# Altium project Motor Driver.PrjPcb
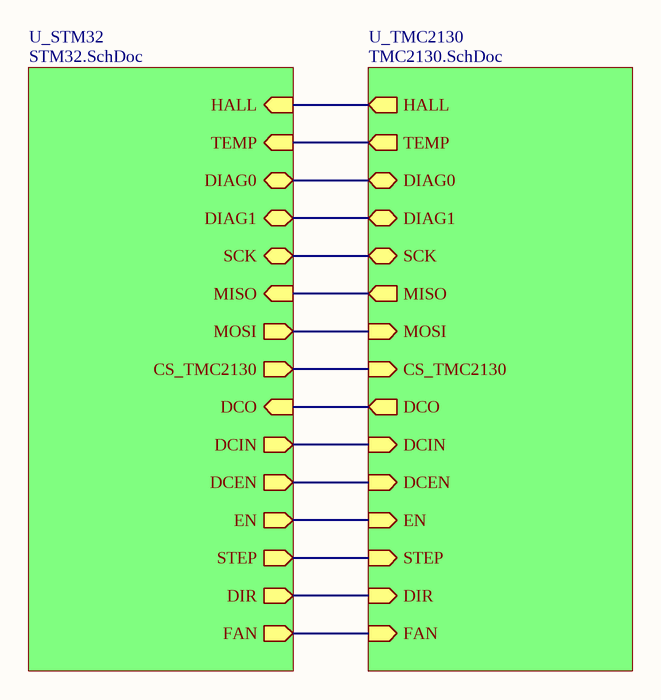
[diagram p0: Top.SchDoc]
3 sheets, 58 parts. Net scope: hierarchical (ports join the sheet entries above them; power ports are global).
Board file: PCB1.PcbDoc
Sheets:
  Top.SchDoc
    U_STM32 = STM32.SchDoc
    U_TMC2130 = TMC2130.SchDoc

## Sheet Top.SchDoc
size A

### Sub-sheets
U_STM32 = STM32.SchDoc: CS_TMC2130 (out), DIR (out), MISO (in), MOSI (out), SCK (bidir), EN (out), DIAG0 (bidir), HALL (in), DCO (in), DCEN (out), TEMP (in), DIAG1 (bidir), DCIN (out), STEP (out), FAN (out)
U_TMC2130 = TMC2130.SchDoc: DIAG1 (bidir), DIAG0 (bidir), DCO (out), DCIN (in), TEMP (out), HALL (out), DCEN (in), MOSI (in), SCK (bidir), MISO (out), STEP (in), DIR (in), EN (in), CS_TMC2130 (in), FAN (in)

### Nets
NetQ1_1: sheet U_STM32/FAN, sheet U_TMC2130/FAN
NetR2_2: sheet U_STM32/TEMP, sheet U_TMC2130/TEMP
NetU1_10: sheet U_STM32/CS_TMC2130, sheet U_TMC2130/CS_TMC2130
NetU1_11: sheet U_STM32/HALL, sheet U_TMC2130/HALL
NetU1_12: sheet U_STM32/EN, sheet U_TMC2130/EN
NetU1_13: sheet U_STM32/STEP, sheet U_TMC2130/STEP
NetU1_14: sheet U_STM32/DIR, sheet U_TMC2130/DIR
NetU1_15: sheet U_STM32/SCK, sheet U_TMC2130/SCK
NetU1_16: sheet U_STM32/MISO, sheet U_TMC2130/MISO
NetU1_17: sheet U_STM32/MOSI, sheet U_TMC2130/MOSI
NetU1_26: sheet U_STM32/DCO, sheet U_TMC2130/DCO
NetU1_27: sheet U_STM32/DCEN, sheet U_TMC2130/DCEN
NetU1_28: sheet U_STM32/DCIN, sheet U_TMC2130/DCIN
NetU1_45: sheet U_STM32/DIAG0, sheet U_TMC2130/DIAG0
NetU1_46: sheet U_STM32/DIAG1, sheet U_TMC2130/DIAG1

## Sheet STM32.SchDoc: Microcontroller & Communication
size A; Author: Luka & Emile; DrawnBy: Luka & Emile; Revision: 0.1; SheetNumber: 1; SheetTotal: 2
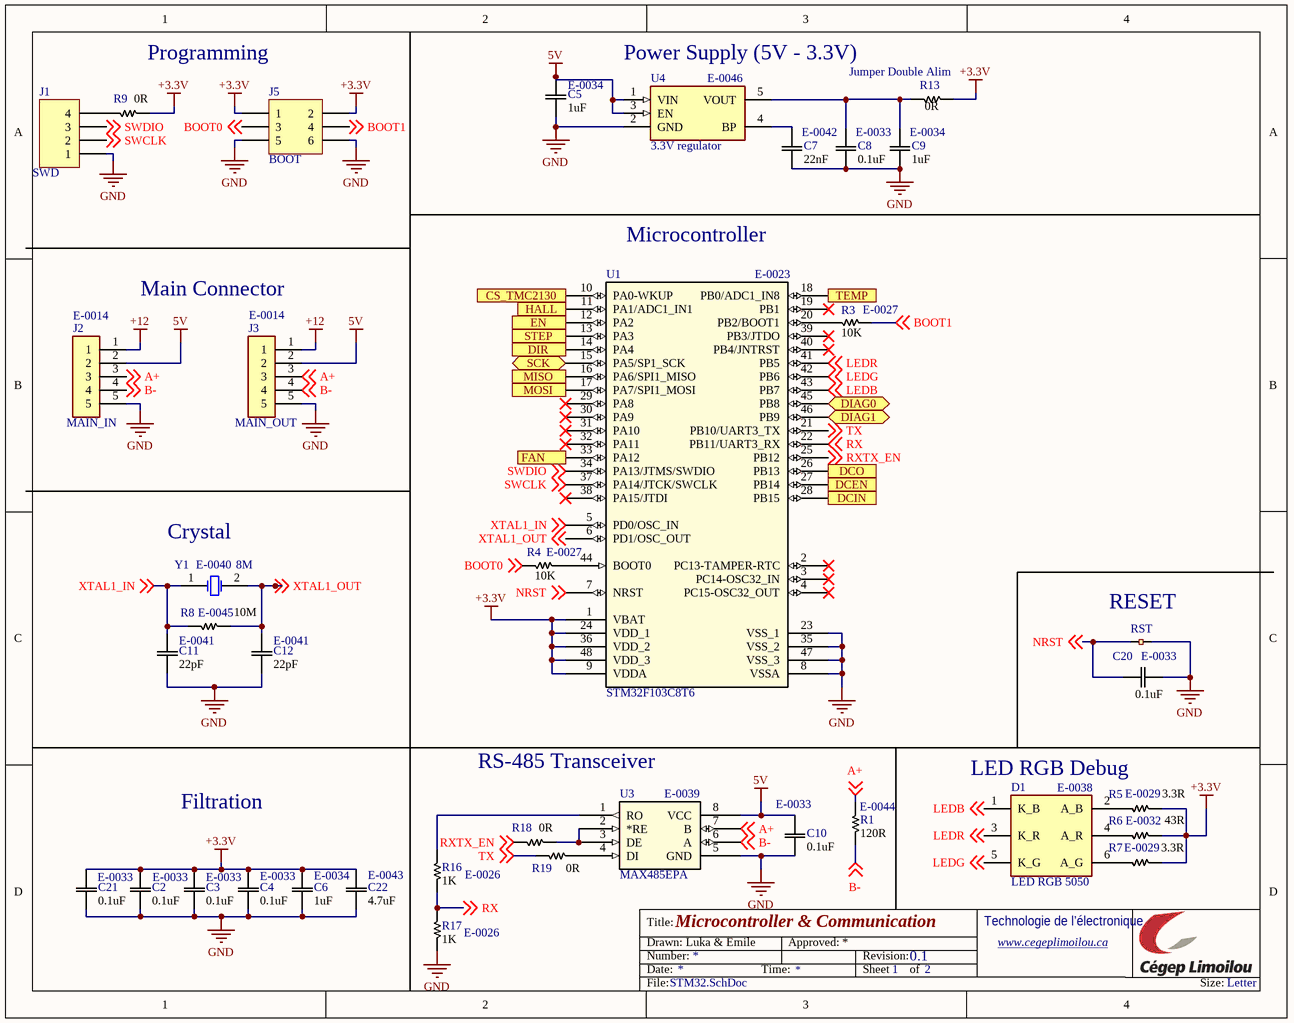
[diagram p1: STM32.SchDoc]

### Parts
C2  value 0.1uF  [0603]  (hidden comment: E-0033)
C3  value 0.1uF  [0603]  (hidden comment: E-0033)
C4  value 0.1uF  [0603]  (hidden comment: E-0033)
C5  value 1uF  [0603]  (hidden comment: E-0034)
C6  value 1uF  [0603]  (hidden comment: E-0034)
C7  value 22nF  [0603]  (hidden comment: E-0042)
C8  value 0.1uF  [0603]  (hidden comment: E-0033)
C9  value 1uF  [0603]  (hidden comment: E-0034)
C10  value 0.1uF  [0603]  (hidden comment: E-0033)
C11  value 22pF  [0603]  (hidden comment: E-0041)
C12  value 22pF  [0603]  (hidden comment: E-0041)
C20  value 0.1uF  [0603]  (hidden comment: E-0033)
C21  value 0.1uF  [0603]  (hidden comment: E-0033)
C22  value 4.7uF  [0603]  (hidden comment: E-0043)
D1  LED RGB 5050  [LED 5050]
J1  SWD  [HDR1X4]
J2  MAIN_IN  [JST 5POS 2.5mm 90°]
J3  MAIN_OUT  [JST 5POS 2.5mm 90°]
J5  BOOT  [Header 3x2 1.27mm SMD]
R1  value 120R  [0603]  (hidden comment: E-0044)
R3  value 10K  [0603]  (hidden comment: E-0027)
R4  value 10K  [0603]  (hidden comment: Resistor 0603)
R5  value 3.3R  [0603]  (hidden comment: E-0029)
R6  value 43R  [0603]  (hidden comment: E-0032)
R7  value 3.3R  [0603]  (hidden comment: E-0029)
R8  value 10M  [0603]  (hidden comment: E-0045)
R9  value 0R  [0603]  (hidden comment: Jumper)
R13  value 0R  [0603]  (hidden comment: Jumper)
R16  value 1K  [0603]  (hidden comment: E-0026)
R17  value 1K  [0603]  (hidden comment: E-0026)
R18  value 0R  [0603]  (hidden comment: Jumper)
R19  value 0R  [0603]  (hidden comment: Jumper)
RST  (no value)  [PAD]
U1  STM32F103C8T6  [LQFP-48]
U3  MAX485EPA  [DIP 8 - 3D]
U4  3.3V regulator  [SOT94P279X130-5N]
Y1  8M  [ATS080B-E]

### Ports
CS_TMC2130 (out), DCEN (out), DCIN (out), DCO (in), DIAG0 (bidir), DIAG1 (bidir), DIR (out), EN (out), FAN (out), HALL (in), MISO (in), MOSI (out), SCK (bidir), STEP (out), TEMP (in)

### Nets
5V: C5.2 C10.2 J2.2 J3.2 U3.8(VCC) U4.1(VIN) U4.3(EN)
+3.3V: C2.2 C3.2 C4.2 C6.2 C21.2 C22.2 J5.1 J5.2 R5.2 R6.2 R7.2 R9.2 R13.2 U1.1(VBAT) U1.9(VDDA) U1.24(VDD_1) U1.36(VDD_2) U1.48(VDD_3)
+12: J2.1 J3.1
GND: C2.1 C3.1 C4.1 C5.1 C6.1 C7.1 C8.1 C9.1 C10.1 C11.1 C12.1 C20.1 C21.1 C22.1 J1.1 J2.5 J3.5 J5.5 J5.6 R17.2 RST.1 U1.8(VSSA) U1.23(VSS_1) U1.35(VSS_2) U1.47(VSS_3) U3.5(GND) U4.2(GND)
A+: J2.3 J3.3 R1.2 U3.7(B) ; off-sheet A+
B-: J2.4 J3.4 R1.1 U3.6(A) ; off-sheet B-
BOOT0: J5.3 R4.1 ; off-sheet BOOT0
BOOT1: J5.4 R3.2 ; off-sheet BOOT1
LEDB: D1.1(K_B) U1.43(PB7) ; off-sheet LEDB
LEDG: D1.5(K_G) U1.42(PB6) ; off-sheet LEDG
LEDR: D1.3(K_R) U1.41(PB5) ; off-sheet LEDR
NRST: C20.2 RST.2 U1.7(NRST) ; off-sheet NRST
RX: R16.2 R17.1 U1.22(PB11/UART3_RX) ; off-sheet RX
RXTX_EN: R18.1 U1.25(PB12) ; off-sheet RXTX_EN
SWCLK: J1.2 U1.37(PA14/JTCK/SWCLK) ; off-sheet SWCLK
SWDIO: J1.3 U1.34(PA13/JTMS/SWDIO) ; off-sheet SWDIO
TX: R19.1 U1.21(PB10/UART3_TX) ; off-sheet TX
XTAL1_IN: C11.2 R8.1 U1.5(PD0/OSC_IN) Y1.1(OSC1) ; off-sheet XTAL1_IN
XTAL1_OUT: C12.2 R8.2 U1.6(PD1/OSC_OUT) Y1.2(OSC2) ; off-sheet XTAL1_OUT
NetC7_2: C7.2 U4.4(BP)
NetC8_2: C8.2 C9.2 R13.1 U4.5(VOUT)
NetD1_2: D1.2(A_B) R5.1
NetD1_4: D1.4(A_R) R6.1
NetD1_6: D1.6(A_G) R7.1
NetJ1_4: J1.4 R9.1
NetQ1_1: U1.33(PA12) ; port FAN
NetR2_2: U1.18(PB0/ADC1_IN8) ; port TEMP
NetR3_1: R3.1 U1.20(PB2/BOOT1)
NetR4_2: R4.2 U1.44(BOOT0)
NetR16_1: R16.1 U3.1(RO)
NetR18_2: R18.2 U3.2(*RE) U3.3(DE)
NetR19_2: R19.2 U3.4(DI)
NetU1_10: U1.10(PA0-WKUP) ; port CS_TMC2130
NetU1_11: U1.11(PA1/ADC1_IN1) ; port HALL
NetU1_12: U1.12(PA2) ; port EN
NetU1_13: U1.13(PA3) ; port STEP
NetU1_14: U1.14(PA4) ; port DIR
NetU1_15: U1.15(PA5/SP1_SCK) ; port SCK
NetU1_16: U1.16(PA6/SPI1_MISO) ; port MISO
NetU1_17: U1.17(PA7/SPI1_MOSI) ; port MOSI
NetU1_26: U1.26(PB13) ; port DCO
NetU1_27: U1.27(PB14) ; port DCEN
NetU1_28: U1.28(PB15) ; port DCIN
NetU1_45: U1.45(PB8) ; port DIAG0
NetU1_46: U1.46(PB9) ; port DIAG1

Not connected (* = marked no-connect by the designer): U1 2(PC13-TAMPER-RTC)* 3(PC14-OSC32_IN)* 4(PC15-OSC32_OUT)* 19(PB1)* 29(PA8)* 30(PA9)* 31(PA10)* 32(PA11)* 38(PA15/JTDI)* 39(PB3/JTDO)* 40(PB4/JNTRST)*

### Notes on the sheet
- Programming
- Power Supply (5V - 3.3V)
- (near R13) Jumper Double Alim
- Main Connector
- Microcontroller
- (near Y1) Crystal
- (near RST) RESET
- (near U3) RS-485 Transceiver
- LED RGB Debug
- Filtration
- Title:
- Number:
- Date:
- Drawn:
- Time:
- Approved:
- Revision:
- Sheet
- of
- Technologie de l’électronique
- www.cegeplimoilou.ca
- File:
- Size:
- Letter

### Library data of the parts
C2-C4 C8 C10 C20 C21 = E-0033: 0.1uF Capacitor 0603 SMD; Manufacturer_Part_Number: C0603C104Z3VACTU; Manufacturer_Name: KEMET; Built_By: Luka & Émile; Vendor: https://www.digikey.ca/product-detail/en/C0603C104Z3VACTU/399-1100-1-ND/411375/?itemSeq=321556474; Copyright: Luka & Émile; Datasheet Link: http://www.koaspeer.com/pdfs/RK73B.pdf; Excel Number: E-0033
C5 C6 C9 = E-0034: 1uf Capacitor 0603 SMD; Manufacturer_Part_Number: CL10A105KA8NNNC; Manufacturer_Name: Samsung Electro-Mechanics; Built_By: Luka & Émile; Vendor: https://www.digikey.ca/product-detail/en/CL10A105KA8NNNC/1276-1102-1-ND/3889188/?itemSeq=321556777; Copyright: Luka & Émile; Datasheet Link: https://www.samsungsem.com/resources/file/global/support/product_catalog/MLCC.pdf; Excel Number: E-0034
C7 = E-0042: 22nF Capacitor 0603 SMD; Manufacturer_Part_Number: C0603C223K1RACTU; Manufacturer_Name: KEMET; Built_By: Luka & Émile; Vendor: https://www.digikey.ca/product-detail/en/kemet/C0603C223K1RACTU/399-3476-1-ND/754769; Copyright: Luka & Émile; Datasheet Link: https://content.kemet.com/datasheets/KEM_C1002_X7R_SMD.pdf; Excel Number: E-0042
C11 C12 = E-0041: 22pF Capacitor 0603 SMD; Manufacturer_Part_Number: C0603C220J1GACTU; Manufacturer_Name: KEMET; Built_By: Luka & Émile; Vendor: https://www.digikey.ca/product-detail/en/kemet/C0603C220J1GACTU/399-7874-1-ND/3471597; Copyright: Luka & Émile; Datasheet Link: https://content.kemet.com/datasheets/KEM_C1003_C0G_SMD.pdf; Excel Number: E-0041
C22 = E-0043: 4.7uF Capacitor 0603 SMD; Manufacturer_Part_Number: C0603C475K9PACTU; Manufacturer_Name: KEMET; Built_By: Luka & Émile; Vendor: https://www.digikey.ca/product-detail/en/kemet/C0603C475K9PACTU/399-3482-1-ND/754775; Copyright: Luka & Émile; Datasheet Link: https://content.kemet.com/datasheets/KEM_C1006_X5R_SMD.pdf; Excel Number: E-0043
D1 = E-0038: Manufacturer_Name: Wurth Elektronik; Manufacturer_Part_Number: 150505M173300; Built_By: Luka & Émile; Datasheet Link: https://www.we-online.de/katalog/datasheet/150505M173300.pdf; Copyright: Luka & Émile; Vendor: https://www.digikey.ca/product-detail/en/w%C3%BCrth-elektronik/150505M173300/732-12000-2-ND/8557165; Excel Number: E-0038
J1 = E-0048: Header, 4POS; Manufacturer_Name: Würth Elektronik; Manufacturer_Part_Number: 61300411121; Built_By: Luka & Émile; Copyright: Luka & Émile; Datasheet Link: https://www.we-online.de/katalog/datasheet/6130xx11121.pdf; Excel Number: E-0048; Vendor: https://www.digikey.ca/product-detail/en/w%C3%BCrth-elektronik/61300411121/732-5317-ND/4846827
J2 J3 = E-0014: Connector JST 5POS; Manufacturer_Name: JST Sales America Inc.; Manufacturer_Part_Number: S5B-XH-A-1(LF)(SN); Built_By: Luka & Émile; Datasheet Link: http://www.jst-mfg.com/product/pdf/eng/eXH.pdf; Copyright: Luka & Émile; Vendor: https://www.digikey.ca/product-detail/en/jst-sales-america-inc/S5B-XH-A-1(LF)(SN)/455-4228-ND/9961924; Excel Number: E-0014
J5 = E-0049: Header, 3-Pin, Dual row; Manufacturer_Name: Sullins Connector Solutions; Manufacturer_Part_Number: GRPB032VWVN-RC; Built_By: Luka & Émile; Copyright: Luka & Émile; Datasheet Link: https://s3.amazonaws.com/catalogspreads-pdf/PAGE94-95%20.050%20MALE%20HDR%20ST%20RA%20SMT.pdf; Excel Number: E-0049; Vendor: https://www.digikey.ca/product-detail/en/sullins-connector-solutions/GRPB032VWVN-RC/S9015E-03-ND/1786453
R1 = E-0044: 120R Resistor 0603 SMD; Manufacturer_Part_Number: KDV06FR120ET; Manufacturer_Name: Ohmite; Built_By: Luka & Émile; Vendor: https://www.digikey.ca/en/products/detail/ohmite/KDV06FR120ET/10476537; Copyright: Luka & Émile; Datasheet Link: https://www.ohmite.com/assets/docs/res_kdv.pdf?r=false; Excel Number: E-0044
R3 R4 = E-0027: 10K Resistor 0603 SMD; Manufacturer_Part_Number: RMCF0603JT10K0; Manufacturer_Name: Stackpole Electronics Inc; Built_By: Luka & Émile; Vendor: https://www.digikey.ca/product-detail/en/RMCF0603JT10K0/RMCF0603JT10K0CT-ND/1943191/?itemSeq=321633246; Copyright: Luka & Émile; Datasheet Link: https://www.seielect.com/catalog/sei-rmcf_rmcp.pdf; Excel Number: E-0027
R5 R7 = E-0029: 3.3R Resistor 0603 SMD; Manufacturer_Part_Number: MCR03ERTJ3R3; Manufacturer_Name: Rohm Semiconductor; Built_By: Luka & Émile; Vendor: https://www.digikey.ca/product-detail/en/MCR03ERTJ3R3/RHM3.3CGCT-ND/4084417/?itemSeq=321633671; Copyright: Luka & Émile; Datasheet Link: https://www.digikey.ca/en/datasheets/rohm-semiconductor/rohm-semiconductor-mcr_g; Excel Number: E-0029
R6 = E-0032: 43R Resistor 0603 SMD; Manufacturer_Part_Number: RK73B1JTTD430J; Manufacturer_Name: KOA Speer Electronics, Inc.; Built_By: Luka & Émile; Vendor: https://www.digikey.ca/product-detail/en/RK73B1JTTD430J/2019-RK73B1JTTD430JCT-ND/9846882/?itemSeq=321674550; Copyright: Luka & Émile; Datasheet Link: http://www.koaspeer.com/pdfs/RK73B.pdf; Excel Number: E-0032
R8 = E-0045: 10M Resistor 0603 SMD; Manufacturer_Part_Number: CRCW060310M0FKEAC; Manufacturer_Name: Vishay Dale; Built_By: Luka & Émile; Vendor: https://www.digikey.ca/en/products/detail/vishay-dale/CRCW060310M0FKEAC/7928470; Copyright: Luka & Émile; Datasheet Link: http://www.vishay.com/docs/28773/crcwce3.pdf; Excel Number: E-0045
R9 R13 R18 R19 = Jumper: Jumper 0603; Built_By: Luka & Émile; Copyright: Luka & Émile
R16 R17 = E-0026: 1K Resistor 0603 SMD; Manufacturer_Part_Number: RK73B1JTTD102J; Manufacturer_Name: KOA Speer Electronics, Inc.; Built_By: Luka & Émile; Vendor: https://www.digikey.ca/product-detail/en/RK73B1JTTD102J/2019-RK73B1JTTD102JCT-ND/9846742/?itemSeq=321579792; Copyright: Luka & Émile; Datasheet Link: http://www.koaspeer.com/pdfs/RK73B.pdf; Excel Number: E-0026
RST = PAD: SMD Pad for contact; Built_By: Luka & Émile; Copyright: Luka & Émile
U1 = E-0023: STM32F103C8T6 Bluepill; Manufacturer_Part_Number: STM32F103C8T6TR; Manufacturer_Name: STMicroelectronics; Built_By: Luka & Émile; Vendor: https://www.digikey.ca/product-detail/en/stmicroelectronics/STM32F103C8T6TR/497-17666-1-ND/7804402; Copyright: Luka & Émile; Datasheet Link: https://www.st.com/resource/en/datasheet/stm32f103cb.pdf; Excel Number: E-0023
U3 = E-0039: RS485 Communication; Manufacturer_Part_Number: MAX485CPA+; Manufacturer_Name: Maxim Integrated; Built_By: Luka & Émile; Vendor: https://www.digikey.ca/product-detail/en/maxim-integrated/MAX485CPA/MAX485CPA-ND/948026; Copyright: Luka & Émile; Excel Number: E-0039; Datasheet Link: https://datasheets.maximintegrated.com/en/ds/MAX1487-MAX491.pdf
U4 = E-0046: Voltage Regulator 3.3V SOT-23-5; Manufacturer_Name: Richtek USA Inc.; Manufacturer_Part_Number: RT9193-28GB; Built_By: Luka & Émile; Datasheet Link: https://www.richtek.com/assets/product_file/RT9193/DS9193-17.pdf; Copyright: Luka & Émile; Vendor: https://www.digikey.ca/product-detail/en/richtek-usa-inc/RT9193-28GB/1028-1072-2-ND/2546936; Excel Number: E-0046
Y1 = E-0040: Crystal 8M; Manufacturer_Name: CTS-Frequency Controls; Built_By: Luka & Émile; Copyright: Luka & Émile; Manufacturer_Part_Number: ATS080B-E; Value: 8M; Datasheet Link: https://www.ctscorp.com/wp-content/uploads/ATS-ATSSM.pdf; Excel Number: E-0040; Vendor: https://www.digikey.ca/product-detail/en/cts-frequency-controls/ATS080B-E/CTX917-ND/2292902

## Sheet TMC2130.SchDoc: Motor Driver & Sensors
size A; Author: Luka & Emile; DrawnBy: Luka & Emile; Revision: 0.1; SheetNumber: 2; SheetTotal: 2
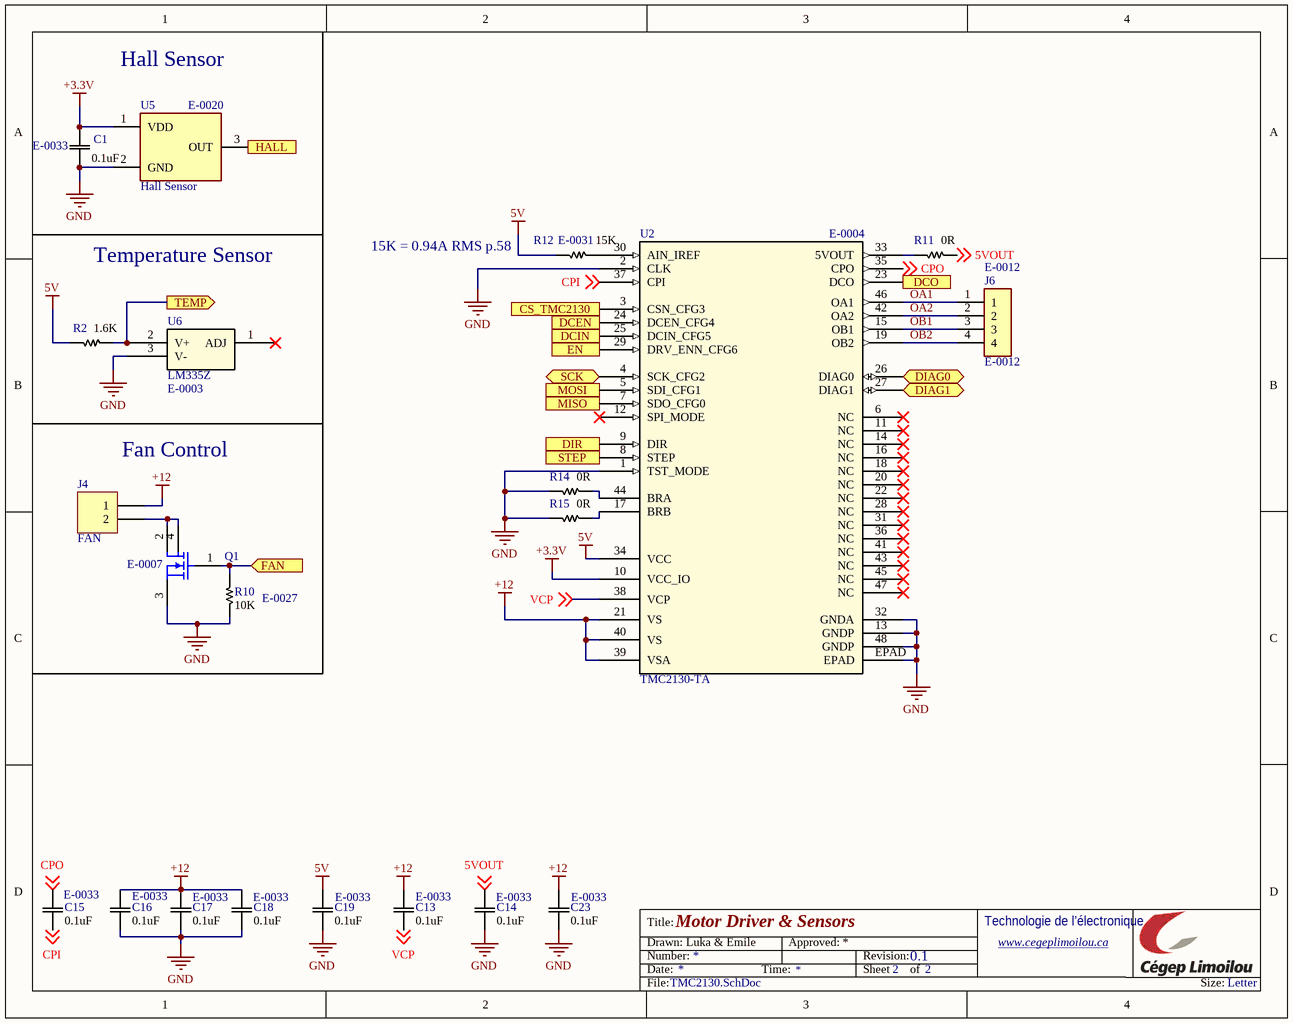
[diagram p2: TMC2130.SchDoc]

### Parts
C1  value 0.1uF  [0603]  (hidden comment: E-0033)
C13  value 0.1uF  [0603]  (hidden comment: E-0033)
C14  value 0.1uF  [0603]  (hidden comment: E-0033)
C15  value 0.1uF  [0603]  (hidden comment: E-0033)
C16  value 0.1uF  [0603]  (hidden comment: E-0033)
C17  value 0.1uF  [0603]  (hidden comment: E-0033)
C18  value 0.1uF  [0603]  (hidden comment: E-0033)
C19  value 0.1uF  [0603]  (hidden comment: E-0033)
C23  value 0.1uF  [0603]  (hidden comment: E-0033)
J4  FAN  [HDR1X2]
J6  E-0012  [JST 4POS 2.5mm 90°]
Q1  E-0007  [SOT223_M]
R2  value 1.6K  [0603]  (hidden comment: E-0050)
R10  value 10K  [0603]  (hidden comment: Resistor 0603)
R11  value 0R  [0603]  (hidden comment: Jumper)
R12  value 15K  [0603]  (hidden comment: E-0031)
R14  value 0R  [0603]  (hidden comment: Jumper)
R15  value 0R  [0603]  (hidden comment: Jumper)
U2  TMC2130-TA  [eTQFP48_9x9]
U5  Hall Sensor  [AH372PB]
U6  LM335Z  [TO92]

### Ports
CS_TMC2130 (in), DCEN (in), DCIN (in), DCO (out), DIAG0 (bidir), DIAG1 (bidir), DIR (in), EN (in), FAN (in), HALL (out), MISO (out), MOSI (in), SCK (bidir), STEP (in), TEMP (out)

### Nets
5V: C19.2 R2.1 R12.1 U2.34(VCC)
+3.3V: C1.2 U2.10(VCC_IO) U5.1(VDD)
+12: C13.2 C16.2 C17.2 C18.2 C23.2 J4.1 U2.21(VS) U2.39(VSA) U2.40(VS)
GND: C1.1 C14.1 C16.1 C17.1 C18.1 C19.1 C23.1 Q1.3(S) R10.1 R14.1 R15.1 U2.1(TST_MODE) U2.2(CLK) U2.13(GNDP) U2.32(GNDA) U2.48(GNDP) U2.EPAD U5.2(GND) U6.3(V-)
5VOUT: C14.2 R11.2 ; off-sheet 5VOUT
CPI: C15.1 U2.37(CPI) ; off-sheet CPI
CPO: C15.2 U2.35(CPO) ; off-sheet CPO
OA1: J6.1 U2.46(OA1)
OA2: J6.2 U2.42(OA2)
OB1: J6.3 U2.15(OB1)
OB2: J6.4 U2.19(OB2)
VCP: C13.1 U2.38(VCP) ; off-sheet VCP
NetJ4_2: J4.2 Q1.2(D) Q1.4(D)
NetQ1_1: Q1.1(G) R10.2 ; port FAN
NetR2_2: R2.2 U6.2(V+) ; port TEMP
NetR11_1: R11.1 U2.33(5VOUT)
NetR12_2: R12.2 U2.30(AIN_IREF)
NetR14_2: R14.2 U2.44(BRA)
NetR15_2: R15.2 U2.17(BRB)
NetU1_10: U2.3(CSN_CFG3) ; port CS_TMC2130
NetU1_11: U5.3(OUT) ; port HALL
NetU1_12: U2.29(DRV_ENN_CFG6) ; port EN
NetU1_13: U2.8(STEP) ; port STEP
NetU1_14: U2.9(DIR) ; port DIR
NetU1_15: U2.4(SCK_CFG2) ; port SCK
NetU1_16: U2.7(SDO_CFG0) ; port MISO
NetU1_17: U2.5(SDI_CFG1) ; port MOSI
NetU1_26: U2.23(DCO) ; port DCO
NetU1_27: U2.24(DCEN_CFG4) ; port DCEN
NetU1_28: U2.25(DCIN_CFG5) ; port DCIN
NetU1_45: U2.26(DIAG0) ; port DIAG0
NetU1_46: U2.27(DIAG1) ; port DIAG1

Not connected (* = marked no-connect by the designer): U2 6(NC)* 11(NC)* 12(SPI_MODE)* 14(NC)* 16(NC)* 18(NC)* 20(NC)* 22(NC)* 28(NC)* 31(NC)* 36(NC)* 41(NC)* 43(NC)* 45(NC)* 47(NC)*; U6 1(ADJ)*

### Notes on the sheet
- Hall Sensor
- Temperature Sensor
- (near R12) 15K = 0.94A RMS p.58
- (near J4) Fan Control
- Title:
- Number:
- Date:
- Drawn:
- Time:
- Approved:
- Revision:
- Sheet
- of
- Technologie de l’électronique
- www.cegeplimoilou.ca
- File:
- Size:
- Letter

### Library data of the parts
C1 C13-C19 C23 = E-0033: as C2 on sheet STM32; Vendor: https://www.digikey.ca/product-detail/en/C0603C104Z3VACTU/399-1100-1-ND/411375/?itemSeq=321556474; Copyright: Luka & Émile; Datasheet Link: http://www.koaspeer.com/pdfs/RK73B.pdf; Excel Number: E-0033
J4 = E-0047: Header, 2-Pin; Manufacturer_Name: Würth Elektronik; Manufacturer_Part_Number: 61300411121; Built_By: Luka & Émile; Copyright: Luka & Émile; Datasheet Link: https://www.we-online.de/katalog/datasheet/6130xx11121.pdf; Excel Number: E-0047; Vendor: 61300411121
J6 = E-0012: Connector JST 4POS; Manufacturer_Name: JST Sales America Inc.; Manufacturer_Part_Number: S4B-XH-A(LF)(SN); Built_By: Luka & Émile; Datasheet Link: http://www.jst-mfg.com/product/pdf/eng/eXH.pdf; Copyright: Luka & Émile; Vendor: https://www.digikey.ca/product-detail/en/jst-sales-america-inc/S4B-XH-A(LF)(SN)/455-2243-ND/1651041; Excel Number: E-0012
Q1 = E-0007: 55V 7A SOT223; Manufacturer_Name: Nexperia USA Inc.; Manufacturer_Part_Number: BUK9880-55A/CUX; Built_By: Luka & Émile; Copyright: Luka & Émile; Datasheet Link: https://assets.nexperia.com/documents/data-sheet/BUK9880-55A.pdf; Excel Number: E-0007; Vendor: https://www.digikey.ca/product-detail/en/nexperia-usa-inc/BUK9880-55A-CUX/1727-2230-1-ND/5361200
R2 = E-0050: 1.6K Resistor 0603 SMD; Manufacturer_Part_Number: CRCW06031K60JNEA; Manufacturer_Name: Vishay Dale; Built_By: Luka & Émile; Vendor: https://www.digikey.ca/en/products/detail/vishay-dale/CRCW06031K60JNEA/1174234; Copyright: Luka & Émile; Excel Number: E-0050; Datasheet Link: N/A
R10 = E-0027: as R3 on sheet STM32; Vendor: https://www.digikey.ca/product-detail/en/RMCF0603JT10K0/RMCF0603JT10K0CT-ND/1943191/?itemSeq=321633246; Copyright: Luka & Émile; Datasheet Link: https://www.seielect.com/catalog/sei-rmcf_rmcp.pdf; Excel Number: E-0027
R11 R14 R15 = Jumper: Jumper 0603; Built_By: Luka & Émile; Copyright: Luka & Émile
R12 = E-0031: 15K Resistor 0603 SMD; Manufacturer_Part_Number: RMCF0603FG15K0; Manufacturer_Name: Stackpole Electronics Inc; Built_By: Luka & Émile; Vendor: https://www.digikey.ca/product-detail/en/RMCF0603FG15K0/RMCF0603FG15K0CT-ND/4425035/?itemSeq=321674385; Copyright: Luka & Émile; Datasheet Link: https://www.seielect.com/catalog/sei-rmcf_rmcp.pdf; Excel Number: E-0031
U2 = E-0004: Motor Driver TMC2130-TA; Manufacturer_Part_Number: TMC2130-TA-T; Manufacturer_Name: Trinamic Motion Control GmbH; Built_By: Luka & Émile; Copyright: Luka & Émile; Vendor: https://www.digikey.ca/product-detail/en/trinamic-motion-control-gmbh/TMC2130-TA-T/1460-1186-1-ND/6572873; Datasheet Link: https://www.trinamic.com/fileadmin/assets/Products/ICs_Documents/TMC2130_datasheet.pdf; Excel Number: E-0004
U5 = E-0020: Manufacturer_Name: Diodes Incorporated; Manufacturer_Part_Number: AH372-P-B; Built_By: Luka & Émile; Datasheet Link: https://www.diodes.com/assets/Datasheets/AH372.pdf; Copyright: Luka & Émile; Vendor: https://www.digikey.ca/products/en?keywords=621-AH372-P-B; Excel Number: E-0020
U6 = E-0003: Temperature Sensor LM335Z; Manufacturer_Name: STMicroelectronics; Built_By: Luka & Émile; VENDOR: https://www.digikey.ca/product-detail/en/stmicroelectronics/LM335Z/497-1584-ND/591686; MANUFACTURER_PART_NUMBER: LM335Z; Copyright: Luka & Émile; Datasheet Link: https://www.st.com/content/ccc/resource/technical/document/datasheet/04/fa/9d/16/39/87/44/8d/CD00000459.pdf/files/CD00000459.pdf/jcr:content/translations/en.CD00000459.pdf; Excel Number: E-0003

## Nets that join several sheets
5V: STM32 (7 pins), TMC2130 (C19.2 R2.1 R12.1 U2.34)
+3.3V: STM32 (18 pins), TMC2130 (C1.2 U2.10 U5.1)
+12: STM32 (J2.1 J3.1), TMC2130 (9 pins)
GND: STM32 (27 pins), TMC2130 (19 pins)
NetQ1_1: STM32 (U1.33), TMC2130 (Q1.1 R10.2)
NetR2_2: STM32 (U1.18), TMC2130 (R2.2 U6.2)
NetU1_10: STM32 (U1.10), TMC2130 (U2.3)
NetU1_11: STM32 (U1.11), TMC2130 (U5.3)
NetU1_12: STM32 (U1.12), TMC2130 (U2.29)
NetU1_13: STM32 (U1.13), TMC2130 (U2.8)
NetU1_14: STM32 (U1.14), TMC2130 (U2.9)
NetU1_15: STM32 (U1.15), TMC2130 (U2.4)
NetU1_16: STM32 (U1.16), TMC2130 (U2.7)
NetU1_17: STM32 (U1.17), TMC2130 (U2.5)
NetU1_26: STM32 (U1.26), TMC2130 (U2.23)
NetU1_27: STM32 (U1.27), TMC2130 (U2.24)
NetU1_28: STM32 (U1.28), TMC2130 (U2.25)
NetU1_45: STM32 (U1.45), TMC2130 (U2.26)
NetU1_46: STM32 (U1.46), TMC2130 (U2.27)